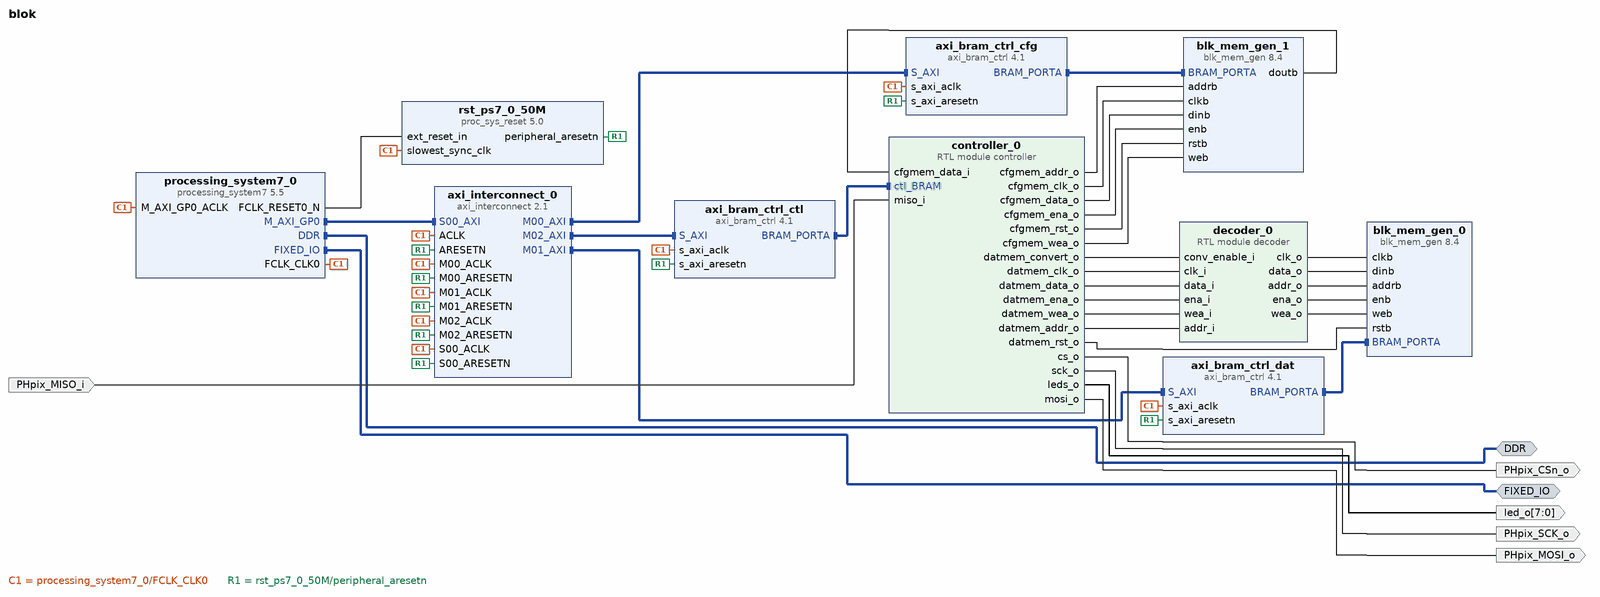
[diagram p0: block diagram of the top level]
# Vivado block design blok, xc7z010clg400-1, Vivado 2020.2
create_bd_design blok

create_bd_intf_port -mode Master -vlnv xilinx.com:interface:ddrx_rtl:1.0 DDR
create_bd_intf_port -mode Master -vlnv xilinx.com:display_processing_system7:fixedio_rtl:1.0 FIXED_IO
create_bd_port -dir O PHpix_MOSI_o
create_bd_port -dir I PHpix_MISO_i
create_bd_port -dir O PHpix_SCK_o
create_bd_port -dir O PHpix_CSn_o
create_bd_port -dir O -from 7 -to 0 led_o

create_bd_cell -type ip -vlnv xilinx.com:ip:processing_system7:5.5 processing_system7_0
set_property -dict [list \
  CONFIG.PCW_APU_PERIPHERAL_FREQMHZ 666.666666 \
  CONFIG.PCW_ENET0_ENET0_IO {MIO 16 .. 27} \
  CONFIG.PCW_ENET0_GRP_MDIO_ENABLE 1 \
  CONFIG.PCW_ENET0_GRP_MDIO_IO {MIO 52 .. 53} \
  CONFIG.PCW_ENET0_PERIPHERAL_ENABLE 1 \
  CONFIG.PCW_ENET0_RESET_ENABLE 0 \
  CONFIG.PCW_ENET_RESET_ENABLE 1 \
  CONFIG.PCW_ENET_RESET_SELECT {Share reset pin} \
  CONFIG.PCW_FCLK_CLK0_BUF FALSE \
  CONFIG.PCW_FPGA0_PERIPHERAL_FREQMHZ 50 \
  CONFIG.PCW_FPGA1_PERIPHERAL_FREQMHZ 50 \
  CONFIG.PCW_GPIO_MIO_GPIO_ENABLE 1 \
  CONFIG.PCW_GPIO_MIO_GPIO_IO MIO \
  CONFIG.PCW_I2C_RESET_ENABLE 1 \
  CONFIG.PCW_IRQ_F2P_INTR 1 \
  CONFIG.PCW_PERIPHERAL_BOARD_PRESET None \
  CONFIG.PCW_PRESET_BANK1_VOLTAGE {LVCMOS 2.5V} \
  CONFIG.PCW_QSPI_GRP_SINGLE_SS_ENABLE 1 \
  CONFIG.PCW_QSPI_GRP_SINGLE_SS_IO {MIO 1 .. 6} \
  CONFIG.PCW_QSPI_PERIPHERAL_ENABLE 1 \
  CONFIG.PCW_QSPI_QSPI_IO {MIO 1 .. 6} \
  CONFIG.PCW_SD0_GRP_CD_ENABLE 1 \
  CONFIG.PCW_SD0_GRP_CD_IO {MIO 46} \
  CONFIG.PCW_SD0_GRP_WP_ENABLE 1 \
  CONFIG.PCW_SD0_GRP_WP_IO {MIO 47} \
  CONFIG.PCW_SD0_PERIPHERAL_ENABLE 1 \
  CONFIG.PCW_SD0_SD0_IO {MIO 40 .. 45} \
  CONFIG.PCW_SDIO_PERIPHERAL_FREQMHZ 100 \
  CONFIG.PCW_SINGLE_QSPI_DATA_MODE x4 \
  CONFIG.PCW_TTC0_PERIPHERAL_ENABLE 1 \
  CONFIG.PCW_TTC0_TTC0_IO EMIO \
  CONFIG.PCW_UART0_PERIPHERAL_ENABLE 1 \
  CONFIG.PCW_UART0_UART0_IO {MIO 14 .. 15} \
  CONFIG.PCW_UART1_PERIPHERAL_ENABLE 0 \
  CONFIG.PCW_UART_PERIPHERAL_FREQMHZ 100 \
  CONFIG.PCW_UIPARAM_DDR_BUS_WIDTH {16 Bit} \
  CONFIG.PCW_UIPARAM_DDR_FREQ_MHZ 533.333333 \
  CONFIG.PCW_UIPARAM_DDR_PARTNO {MT41J256M16 RE-125} \
  CONFIG.PCW_USB0_PERIPHERAL_ENABLE 0 \
  CONFIG.PCW_USB_RESET_ENABLE 1 \
  CONFIG.PCW_USE_FABRIC_INTERRUPT 1 \
] [get_bd_cells processing_system7_0]
# 511 more settings of processing_system7_0 are not shown: defaults, MIO pin electricals, DDR timing, and values the tool derives
create_bd_cell -type ip -vlnv xilinx.com:ip:axi_interconnect:2.1 axi_interconnect_0
set_property -dict {CONFIG.NUM_MI 3} [get_bd_cells axi_interconnect_0]
create_bd_cell -type ip -vlnv xilinx.com:ip:proc_sys_reset:5.0 rst_ps7_0_50M
create_bd_cell -type ip -vlnv xilinx.com:ip:axi_bram_ctrl:4.1 axi_bram_ctrl_cfg
set_property -dict {CONFIG.SINGLE_PORT_BRAM 1} [get_bd_cells axi_bram_ctrl_cfg]
create_bd_cell -type ip -vlnv xilinx.com:ip:axi_bram_ctrl:4.1 axi_bram_ctrl_dat
set_property -dict {CONFIG.SINGLE_PORT_BRAM 1} [get_bd_cells axi_bram_ctrl_dat]
create_bd_cell -type ip -vlnv xilinx.com:ip:axi_bram_ctrl:4.1 axi_bram_ctrl_ctl
set_property -dict {CONFIG.SINGLE_PORT_BRAM 1} [get_bd_cells axi_bram_ctrl_ctl]
create_bd_cell -type ip -vlnv xilinx.com:ip:blk_mem_gen:8.4 blk_mem_gen_0
set_property -dict [list \
  CONFIG.Enable_B Use_ENB_Pin \
  CONFIG.Memory_Type True_Dual_Port_RAM \
  CONFIG.Port_B_Clock 100 \
  CONFIG.Port_B_Enable_Rate 100 \
  CONFIG.Port_B_Write_Rate 50 \
  CONFIG.Use_RSTB_Pin true \
] [get_bd_cells blk_mem_gen_0]
create_bd_cell -type ip -vlnv xilinx.com:ip:blk_mem_gen:8.4 blk_mem_gen_1
set_property -dict [list \
  CONFIG.Enable_B Use_ENB_Pin \
  CONFIG.Memory_Type True_Dual_Port_RAM \
  CONFIG.Port_B_Clock 100 \
  CONFIG.Port_B_Enable_Rate 100 \
  CONFIG.Port_B_Write_Rate 50 \
  CONFIG.Use_RSTB_Pin true \
] [get_bd_cells blk_mem_gen_1]
create_bd_cell -type module -reference decoder decoder_0
create_bd_cell -type module -reference controller controller_0

# ---- connections ----

connect_bd_intf_net [get_bd_intf_pins axi_interconnect_0/M00_AXI] [get_bd_intf_pins axi_bram_ctrl_cfg/S_AXI]
connect_bd_intf_net [get_bd_intf_ports DDR] [get_bd_intf_pins processing_system7_0/DDR]
connect_bd_intf_net -intf_net axi_bram_ctrl_0_BRAM_PORTA [get_bd_intf_pins axi_bram_ctrl_cfg/BRAM_PORTA] [get_bd_intf_pins blk_mem_gen_1/BRAM_PORTA]
connect_bd_intf_net [get_bd_intf_pins axi_interconnect_0/M01_AXI] [get_bd_intf_pins axi_bram_ctrl_dat/S_AXI]
connect_bd_intf_net [get_bd_intf_pins axi_interconnect_0/M02_AXI] [get_bd_intf_pins axi_bram_ctrl_ctl/S_AXI]
connect_bd_intf_net [get_bd_intf_pins axi_bram_ctrl_ctl/BRAM_PORTA] [get_bd_intf_pins controller_0/ctl_BRAM]
connect_bd_intf_net [get_bd_intf_ports FIXED_IO] [get_bd_intf_pins processing_system7_0/FIXED_IO]
connect_bd_intf_net [get_bd_intf_pins processing_system7_0/M_AXI_GP0] [get_bd_intf_pins axi_interconnect_0/S00_AXI]
connect_bd_intf_net -intf_net axi_bram_ctrl_1_BRAM_PORTA [get_bd_intf_pins axi_bram_ctrl_dat/BRAM_PORTA] [get_bd_intf_pins blk_mem_gen_0/BRAM_PORTA]
connect_bd_net -net ACLK_1 [get_bd_pins processing_system7_0/FCLK_CLK0] \
  [get_bd_pins processing_system7_0/M_AXI_GP0_ACLK] [get_bd_pins axi_interconnect_0/ACLK] \
  [get_bd_pins rst_ps7_0_50M/slowest_sync_clk] [get_bd_pins axi_interconnect_0/S00_ACLK] \
  [get_bd_pins axi_interconnect_0/M00_ACLK] [get_bd_pins axi_interconnect_0/M01_ACLK] \
  [get_bd_pins axi_interconnect_0/M02_ACLK] [get_bd_pins axi_bram_ctrl_cfg/s_axi_aclk] \
  [get_bd_pins axi_bram_ctrl_dat/s_axi_aclk] [get_bd_pins axi_bram_ctrl_ctl/s_axi_aclk]
connect_bd_net [get_bd_pins processing_system7_0/FCLK_RESET0_N] [get_bd_pins rst_ps7_0_50M/ext_reset_in]
connect_bd_net [get_bd_pins rst_ps7_0_50M/peripheral_aresetn] \
  [get_bd_pins axi_interconnect_0/ARESETN] [get_bd_pins axi_interconnect_0/S00_ARESETN] \
  [get_bd_pins axi_interconnect_0/M00_ARESETN] [get_bd_pins axi_interconnect_0/M01_ARESETN] \
  [get_bd_pins axi_interconnect_0/M02_ARESETN] [get_bd_pins axi_bram_ctrl_cfg/s_axi_aresetn] \
  [get_bd_pins axi_bram_ctrl_dat/s_axi_aresetn] [get_bd_pins axi_bram_ctrl_ctl/s_axi_aresetn]
connect_bd_net [get_bd_pins controller_0/cs_o] [get_bd_ports PHpix_CSn_o]
connect_bd_net [get_bd_pins controller_0/sck_o] [get_bd_ports PHpix_SCK_o]
connect_bd_net [get_bd_pins controller_0/leds_o] [get_bd_ports led_o]
connect_bd_net [get_bd_pins controller_0/cfgmem_addr_o] [get_bd_pins blk_mem_gen_1/addrb]
connect_bd_net [get_bd_pins controller_0/cfgmem_clk_o] [get_bd_pins blk_mem_gen_1/clkb]
connect_bd_net [get_bd_pins controller_0/cfgmem_data_o] [get_bd_pins blk_mem_gen_1/dinb]
connect_bd_net [get_bd_pins blk_mem_gen_1/doutb] [get_bd_pins controller_0/cfgmem_data_i]
connect_bd_net [get_bd_pins controller_0/cfgmem_ena_o] [get_bd_pins blk_mem_gen_1/enb]
connect_bd_net [get_bd_pins controller_0/cfgmem_rst_o] [get_bd_pins blk_mem_gen_1/rstb]
connect_bd_net [get_bd_pins controller_0/cfgmem_wea_o] [get_bd_pins blk_mem_gen_1/web]
connect_bd_net [get_bd_pins controller_0/mosi_o] [get_bd_ports PHpix_MOSI_o]
connect_bd_net [get_bd_ports PHpix_MISO_i] [get_bd_pins controller_0/miso_i]
connect_bd_net [get_bd_pins controller_0/datmem_convert_o] [get_bd_pins decoder_0/conv_enable_i]
connect_bd_net [get_bd_pins decoder_0/clk_o] [get_bd_pins blk_mem_gen_0/clkb]
connect_bd_net [get_bd_pins decoder_0/data_o] [get_bd_pins blk_mem_gen_0/dinb]
connect_bd_net [get_bd_pins decoder_0/addr_o] [get_bd_pins blk_mem_gen_0/addrb]
connect_bd_net [get_bd_pins decoder_0/ena_o] [get_bd_pins blk_mem_gen_0/enb]
connect_bd_net [get_bd_pins decoder_0/wea_o] [get_bd_pins blk_mem_gen_0/web]
connect_bd_net [get_bd_pins controller_0/datmem_clk_o] [get_bd_pins decoder_0/clk_i]
connect_bd_net [get_bd_pins controller_0/datmem_rst_o] [get_bd_pins blk_mem_gen_0/rstb]
connect_bd_net [get_bd_pins controller_0/datmem_data_o] [get_bd_pins decoder_0/data_i]
connect_bd_net [get_bd_pins controller_0/datmem_ena_o] [get_bd_pins decoder_0/ena_i]
connect_bd_net [get_bd_pins controller_0/datmem_wea_o] [get_bd_pins decoder_0/wea_i]
connect_bd_net [get_bd_pins controller_0/datmem_addr_o] [get_bd_pins decoder_0/addr_i]
set_property HDL_ATTRIBUTE.BMM_INFO_PROCESSOR {arm > blok axi_bram_ctrl_cfg blok axi_bram_ctrl_dat} [get_bd_cells processing_system7_0]
set_property HDL_ATTRIBUTE.KEEP_HIERARCHY yes [get_bd_cells processing_system7_0]
set_property HDL_ATTRIBUTE.BMM_INFO_ADDRESS_SPACE {byte  0x40000000 32 > blok blk_mem_gen_1} [get_bd_cells axi_bram_ctrl_cfg]
set_property HDL_ATTRIBUTE.KEEP_HIERARCHY yes [get_bd_cells axi_bram_ctrl_cfg]
set_property HDL_ATTRIBUTE.BMM_INFO_ADDRESS_SPACE {byte  0x42000000 32 > blok blk_mem_gen_0} [get_bd_cells axi_bram_ctrl_dat]
set_property HDL_ATTRIBUTE.KEEP_HIERARCHY yes [get_bd_cells axi_bram_ctrl_dat]

# ---- address map ----
assign_bd_address -offset 0x40000000 -range 32K -target_address_space [get_bd_addr_spaces processing_system7_0/Data] [get_bd_addr_segs axi_bram_ctrl_cfg/S_AXI/Mem0]
assign_bd_address -offset 0x42000000 -range 32K -target_address_space [get_bd_addr_spaces processing_system7_0/Data] [get_bd_addr_segs axi_bram_ctrl_dat/S_AXI/Mem0]
assign_bd_address -offset 0x44000000 -range 8K -target_address_space [get_bd_addr_spaces processing_system7_0/Data] [get_bd_addr_segs axi_bram_ctrl_ctl/S_AXI/Mem0]

validate_bd_design
save_bd_design
